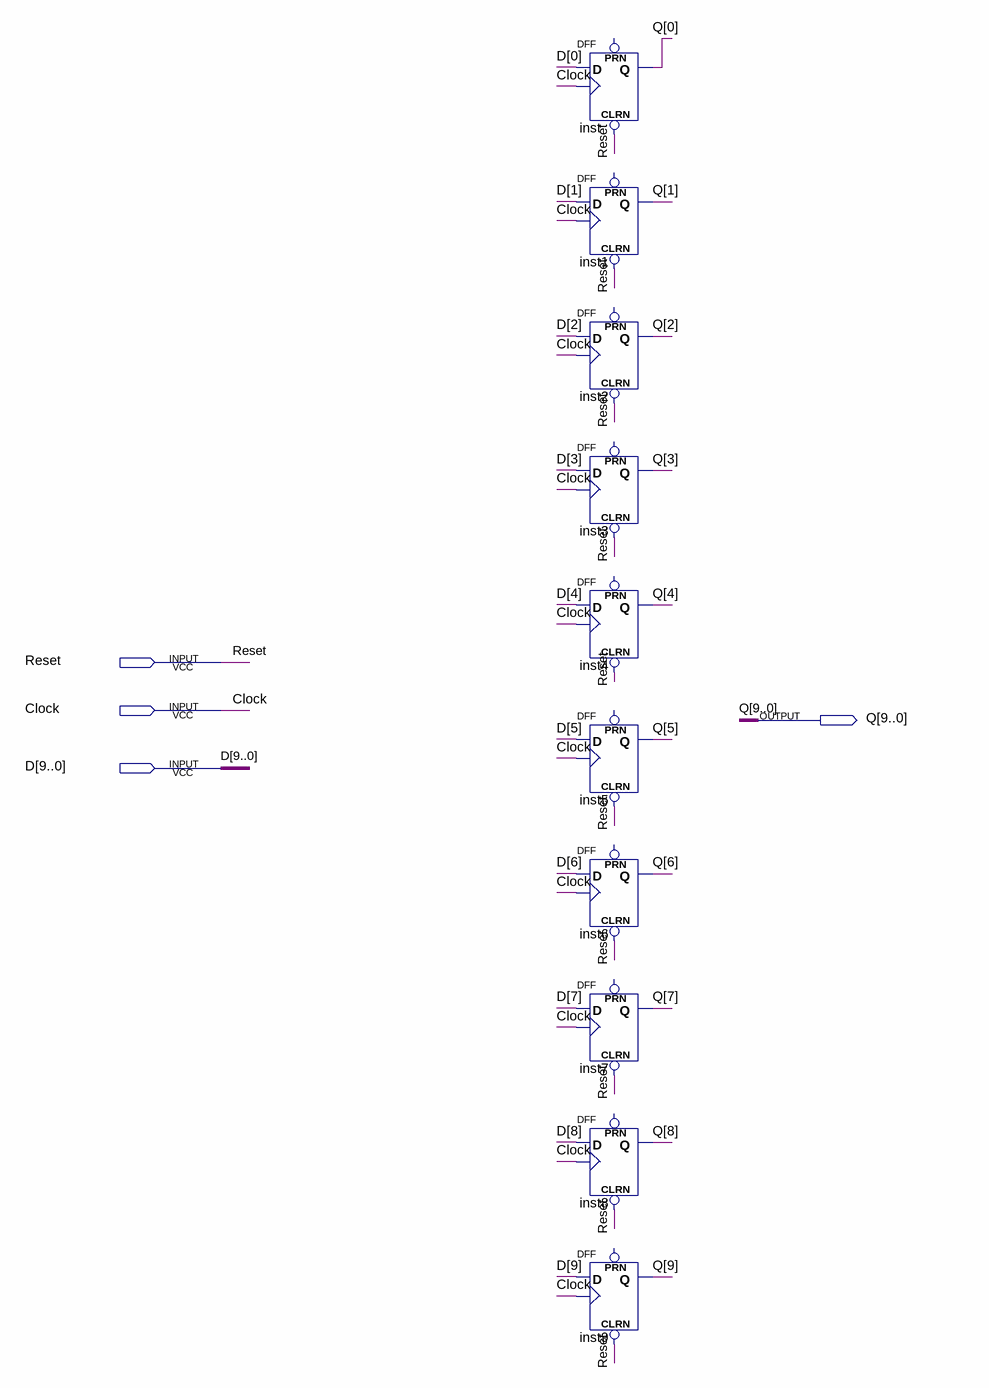
[diagram p0: schematic sheet]
// Quartus schematic TenBitReg.bdf as structural Verilog: 10 symbols, 4 pins
module TenBitReg (
  input  Reset,
  input  Clock,
  input  [9:0] D,
  output [9:0] Q
);

  DFF inst (.CLRN(Reset), .CLK(Clock), .D(D[0]), .Q(Q[0]));  // open: PRN
  DFF inst1 (.CLRN(Reset), .CLK(Clock), .D(D[1]), .Q(Q[1]));  // open: PRN
  DFF inst2 (.CLRN(Reset), .CLK(Clock), .D(D[2]), .Q(Q[2]));  // open: PRN
  DFF inst3 (.CLRN(Reset), .CLK(Clock), .D(D[3]), .Q(Q[3]));  // open: PRN
  DFF inst4 (.CLRN(Reset), .CLK(Clock), .D(D[4]), .Q(Q[4]));  // open: PRN
  DFF inst5 (.CLRN(Reset), .CLK(Clock), .D(D[5]), .Q(Q[5]));  // open: PRN
  DFF inst6 (.CLRN(Reset), .CLK(Clock), .D(D[6]), .Q(Q[6]));  // open: PRN
  DFF inst7 (.CLRN(Reset), .CLK(Clock), .D(D[7]), .Q(Q[7]));  // open: PRN
  DFF inst8 (.CLRN(Reset), .CLK(Clock), .D(D[8]), .Q(Q[8]));  // open: PRN
  DFF inst9 (.CLRN(Reset), .CLK(Clock), .D(D[9]), .Q(Q[9]));  // open: PRN
endmodule
